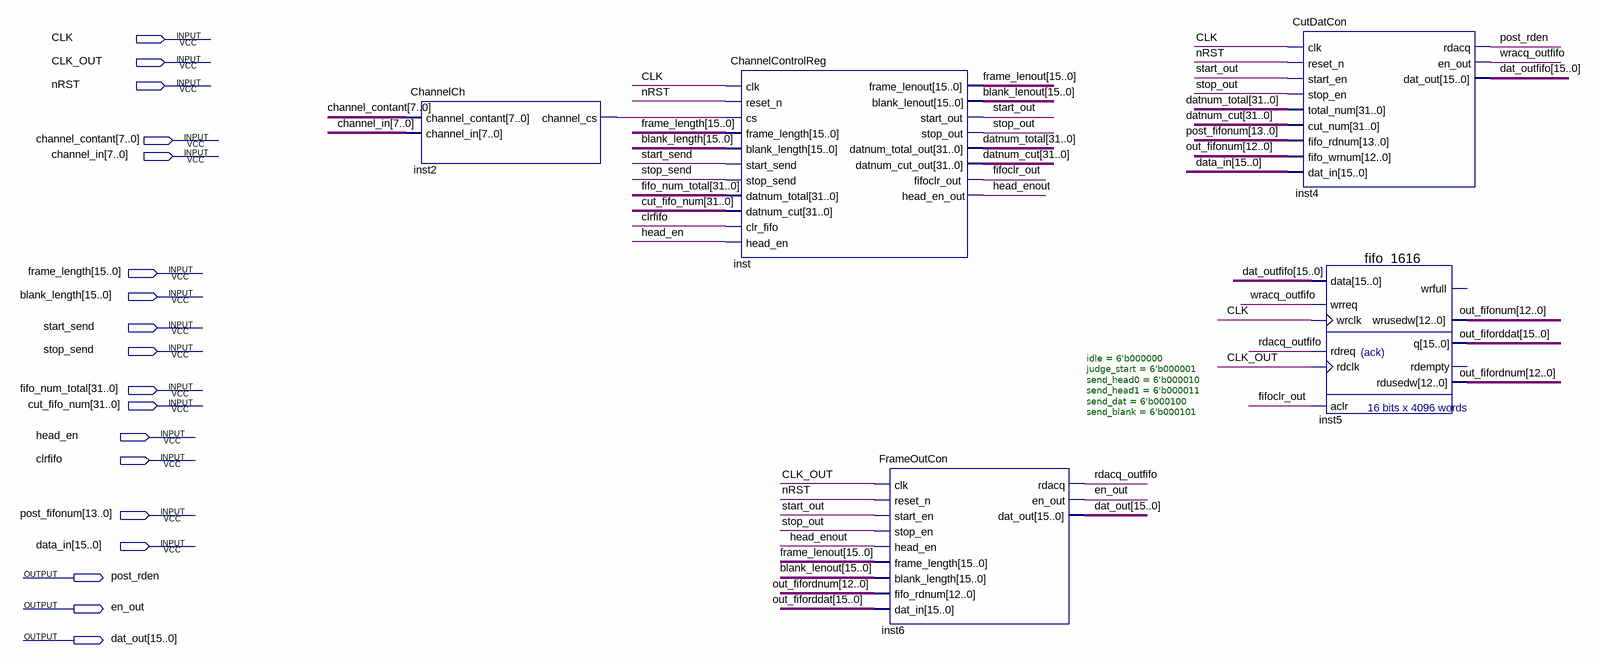
[diagram p0: schematic sheet]
// Quartus schematic SourceChannelBdf.bdf as structural Verilog: 5 symbols, 18 pins
module SourceChannelBdf (
  input  CLK,
  input  CLK_OUT,
  input  nRST,
  input  [7:0] channel_contant,
  input  [7:0] channel_in,
  input  [15:0] frame_length,
  input  [15:0] blank_length,
  input  start_send,
  input  stop_send,
  input  [31:0] fifo_num_total,
  input  [31:0] cut_fifo_num,
  input  head_en,
  input  clrfifo,
  input  [13:0] post_fifonum,
  input  [15:0] data_in,
  output post_rden,
  output en_out,
  output [15:0] dat_out
);

  wire fifoclr_out, head_enout, inst2_channel_cs, rdacq_outfifo, start_out, stop_out, wracq_outfifo;
  wire [12:0] out_fifonum, out_fifordnum;
  wire [15:0] blank_lenout, dat_outfifo, frame_lenout, out_fiforddat;
  wire [31:0] datnum_cut, datnum_total;

  ChannelCh inst2 (.channel_contant(channel_contant), .channel_in(channel_in), .channel_cs(inst2_channel_cs));
  ChannelControlReg inst (
    .clk(CLK), .reset_n(nRST), .cs(inst2_channel_cs), .frame_length(frame_length),
    .blank_length(blank_length), .start_send(start_send), .stop_send(stop_send),
    .datnum_total(fifo_num_total), .datnum_cut(cut_fifo_num), .clr_fifo(clrfifo), .head_en(head_en),
    .frame_lenout(frame_lenout), .blank_lenout(blank_lenout), .start_out(start_out), .stop_out(stop_out),
    .datnum_total_out(datnum_total), .datnum_cut_out(datnum_cut), .fifoclr_out(fifoclr_out),
    .head_en_out(head_enout));
  FrameOutCon #(.idle(6'b000000), .judge_start(6'b000001), .send_head0(6'b000010), .send_head1(6'b000011), .send_dat(6'b000100), .send_blank(6'b000101)) inst6 (
    .clk(CLK_OUT), .reset_n(nRST), .start_en(start_out), .stop_en(stop_out), .head_en(head_enout),
    .frame_length(frame_lenout), .blank_length(blank_lenout), .fifo_rdnum(out_fifordnum),
    .dat_in(out_fiforddat), .rdacq(rdacq_outfifo), .en_out(en_out), .dat_out(dat_out));
  CutDatCon inst4 (
    .clk(CLK), .reset_n(nRST), .start_en(start_out), .stop_en(stop_out), .total_num(datnum_total),
    .cut_num(datnum_cut), .fifo_rdnum(post_fifonum), .fifo_wrnum(out_fifonum), .dat_in(data_in),
    .rdacq(post_rden), .en_out(wracq_outfifo), .dat_out(dat_outfifo));
  fifo_1616 inst5 (
    .data(dat_outfifo), .wrreq(wracq_outfifo), .wrclk(CLK), .rdreq(rdacq_outfifo), .rdclk(CLK_OUT),
    .aclr(fifoclr_out), .wrusedw(out_fifonum), .q(out_fiforddat), .rdusedw(out_fifordnum));  // open: wrfull, rdempty
endmodule
